# Altium project Intelligent-bookcase-management-system.PrjPcb
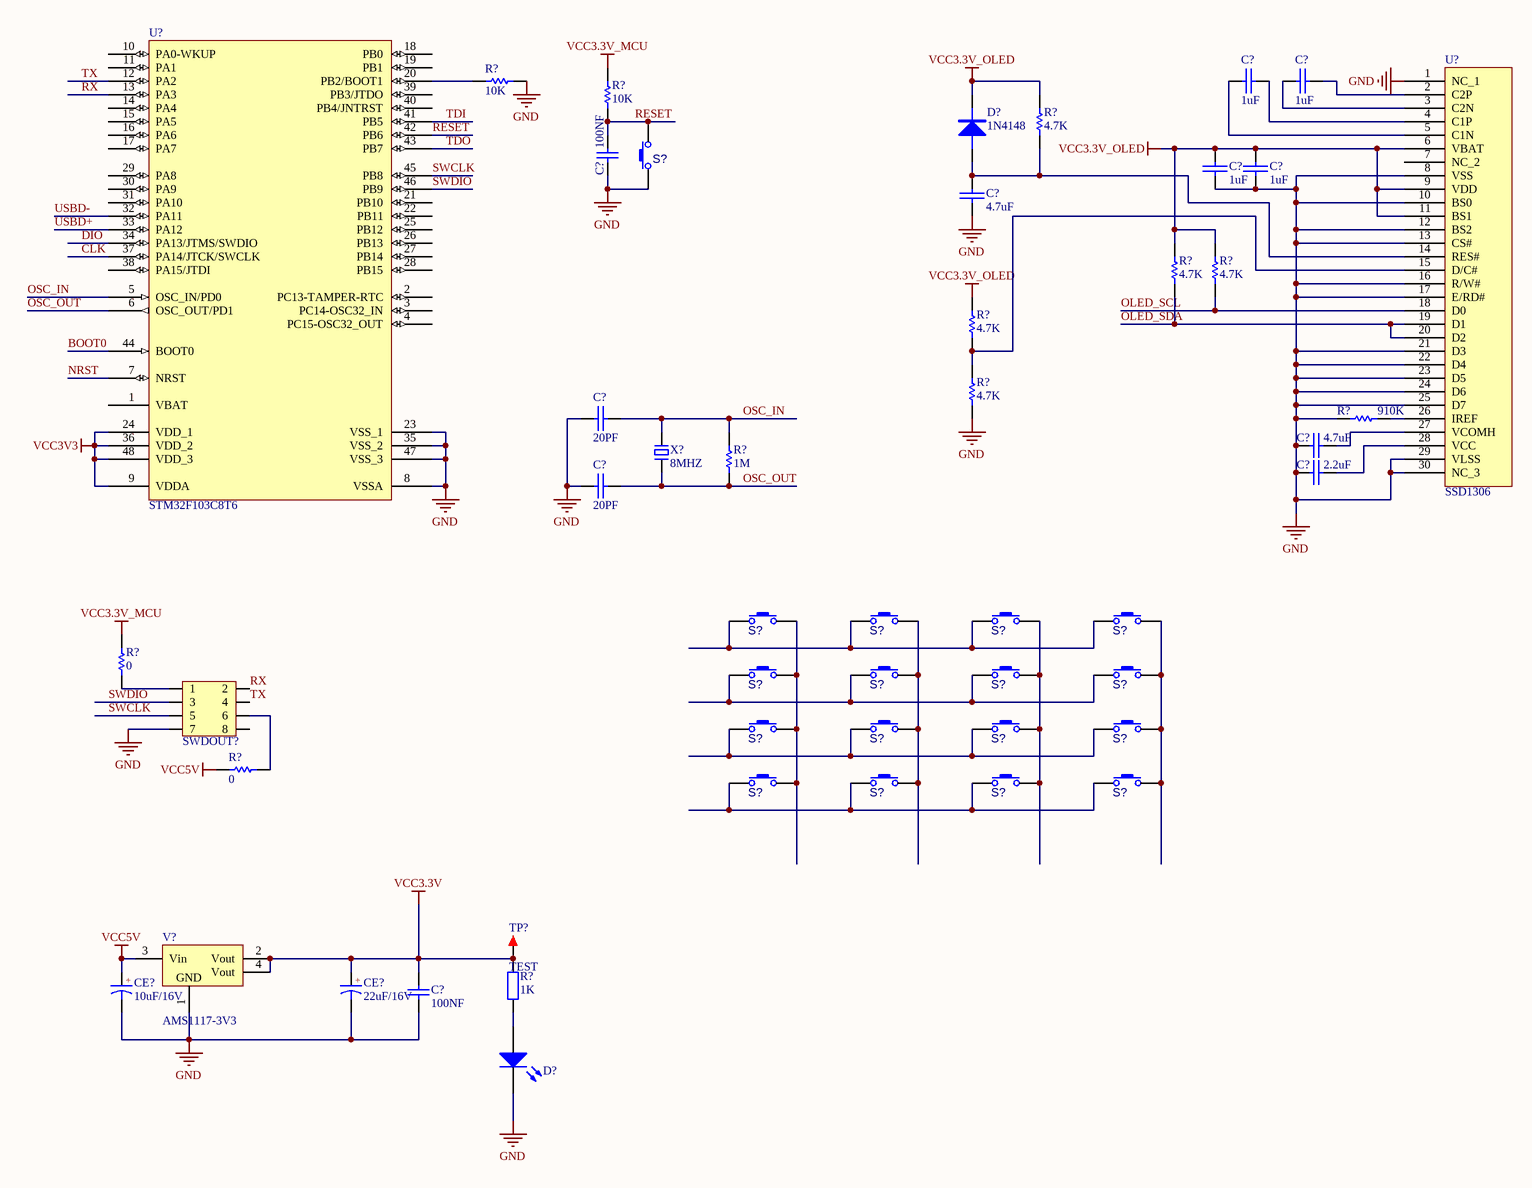
[diagram p0: Intelligent-bookcase-management-system.SchDoc]
1 sheet, 50 parts. Net scope: global (net labels, ports and power ports of the same name join across sheets).
Board file: Intelligent-bookcase-management-system.PcbDoc

## Sheet Intelligent-bookcase-management-system.SchDoc
size A3; SheetNumber: 1; SheetTotal: 1

### Parts
(Parts that share a designator on the sheet are numbered #1, #2 ... from top to bottom, then left to right.)
C?#1  1uF  [0603C]
C?#2  1uF  [0603C]
C?#3  100NF  [0603C]
C?#4  4.7uF  [0603C]
C?#5  1uF  [0603C]
C?#6  1uF  [0603C]
C?#7  20PF  [0402C]
C?#8  4.7uF  [0603C]
C?#9  2.2uF  [0603C]
C?#10  20PF  [0402C]
C?#11  100NF  [0603C]
CE?#1  10uF/16V  [DIP-EC2.0X5X11]
CE?#2  22uF/16V  [DIP-EC2.0X5X11]
D?#1  1N4148  [SOD-323]
D?#2  LED  [LED 0603W]  (value not drawn)
R?#1  10K  [0603R]
R?#2  10K  [0603R]
R?#3  4.7K  [0603R]
R?#4  4.7K  [0603R]
R?#5  4.7K  [0603R]
R?#6  4.7K  [0603R]
R?#7  4.7K  [0603R]
R?#8  910K  [0603R]
R?#9  1M  [0402R]
R?#10  0  [0603R]
R?#11  0  [0603R]
R?#12  1K  [0603R]
S?#1  Button  [SW-SMD_L6.0-W6.0-LS6.6]  (value not drawn)
S?#2  Button  [SW-SMD_L6.0-W6.0-LS6.6]  (value not drawn)
S?#3  Button  [SW-SMD_L6.0-W6.0-LS6.6]  (value not drawn)
S?#4  Button  [SW-SMD_L6.0-W6.0-LS6.6]  (value not drawn)
S?#5  Button  [SW-SMD_L6.0-W6.0-LS6.6]  (value not drawn)
S?#6  Button  [SW-SMD_L6.0-W6.0-LS6.6]  (value not drawn)
S?#7  Button  [SW-SMD_L6.0-W6.0-LS6.6]  (value not drawn)
S?#8  Button  [SW-SMD_L6.0-W6.0-LS6.6]  (value not drawn)
S?#9  Button  [SW-SMD_L6.0-W6.0-LS6.6]  (value not drawn)
S?#10  Button  [SW-SMD_L6.0-W6.0-LS6.6]  (value not drawn)
S?#11  Button  [SW-SMD_L6.0-W6.0-LS6.6]  (value not drawn)
S?#12  Button  [SW-SMD_L6.0-W6.0-LS6.6]  (value not drawn)
S?#13  Button  [SW-SMD_L6.0-W6.0-LS6.6]  (value not drawn)
S?#14  Button  [SW-SMD_L6.0-W6.0-LS6.6]  (value not drawn)
S?#15  Button  [SW-SMD_L6.0-W6.0-LS6.6]  (value not drawn)
S?#16  Button  [SW-SMD_L6.0-W6.0-LS6.6]  (value not drawn)
S?#17  Button  [SW-SMD_L6.0-W6.0-LS6.6]  (value not drawn)
SWDOUT?  HDR2x4_2.54  [Pin HDR2X4/2.54mm-S]  (value not drawn)
TP?  TEST  [TEST 1.6]
U?#1  STM32F103C8T6  [LQFP48 7X7]
U?#2  SSD1306  [OLED_0.96-30P-P0.70-12864]
V?  AMS1117-3V3  [SOT223]
X?  8MHZ  [OSC HC-49SMD]

### Nets
GND: C?#3.1 C?#4.2 C?#5.1 C?#6.1 C?#7.2 C?#8.2 C?#9.2 C?#10.2 C?#11.2 CE?#1.2 CE?#2.2 D?#2.2(K) R?#1.1 R?#7.1 R?#8.2 S?#1.2 SWDOUT?.7 U?#1.8(VSSA) U?#1.23(VSS_1) U?#1.35(VSS_2) U?#1.47(VSS_3) U?#2.1(NC_1) U?#2.8(VSS) U?#2.10(BS0) U?#2.12(BS2) U?#2.13(CS#) U?#2.16(R/W#) U?#2.17(E/RD#) U?#2.21(D3) U?#2.22(D4) U?#2.23(D5) U?#2.24(D6) U?#2.25(D7) U?#2.29(VLSS) U?#2.30(NC_3) V?.1(GND)
VCC3.3V: C?#11.1 CE?#2.1 R?#12.2 TP?.1 V?.2(Vout) V?.4(Vout)
VCC3.3V_MCU: R?#2.2 R?#10.2
VCC3.3V_OLED: C?#5.2 C?#6.2 D?#1.K R?#3.2 R?#4.2 R?#5.2 R?#6.2 U?#2.6(VBAT) U?#2.9(VDD) U?#2.11(BS1)
VCC3V3: U?#1.9(VDDA) U?#1.24(VDD_1) U?#1.36(VDD_2) U?#1.48(VDD_3)
VCC5V: CE?#1.1 R?#11.2 V?.3(Vin)
BOOT0: U?#1.44(BOOT0)
CLK: U?#1.37(PA14/JTCK/SWCLK)
DIO: U?#1.34(PA13/JTMS/SWDIO)
NRST: U?#1.7(NRST)
OLED_SCL: R?#5.1 U?#2.18(D0)
OLED_SDA: R?#4.1 U?#2.19(D1) U?#2.20(D2)
OSC_IN: C?#7.1 R?#9.2 U?#1.5(OSC_IN/PD0) X?.2
OSC_OUT: C?#10.1 R?#9.1 U?#1.6(OSC_OUT/PD1) X?.1
RESET: C?#3.2 R?#2.1 S?#1.1 U?#1.42(PB6)
RX: SWDOUT?.2 U?#1.13(PA3)
SWCLK: SWDOUT?.5 U?#1.45(PB8)
SWDIO: SWDOUT?.3 U?#1.46(PB9)
TDI: U?#1.41(PB5)
TDO: U?#1.43(PB7)
TX: SWDOUT?.4 U?#1.12(PA2)
USBD+: U?#1.33(PA12)
USBD-: U?#1.32(PA11)
NetC?#1_1: C?#1.1 U?#2.5(C1N)
NetC?#1_2: C?#1.2 U?#2.4(C1P)
NetC?#2_1: C?#2.1 U?#2.3(C2N)
NetC?#2_2: C?#2.2 U?#2.2(C2P)
NetC?#4_1: C?#4.1 D?#1.A R?#3.1 U?#2.14(RES#)
NetC?#8_1: C?#8.1 U?#2.27(VCOMH)
NetC?#9_1: C?#9.1 U?#2.28(VCC)
NetD?#2_1: D?#2.1(A) R?#12.1
NetR?#1_2: R?#1.2 U?#1.20(PB2/BOOT1)
NetR?#6_1: R?#6.1 R?#7.2 U?#2.15(D/C#)
NetR?#8_1: R?#8.1 U?#2.26(IREF)
NetR?#10_1: R?#10.1 SWDOUT?.1
NetR?#11_1: R?#11.1 SWDOUT?.6
NetS?#2_1: S?#2.1 S?#6.1 S?#10.1 S?#14.1
NetS?#2_2: S?#2.2 S?#3.2 S?#4.2 S?#5.2
NetS?#3_1: S?#3.1 S?#7.1 S?#11.1 S?#15.1
NetS?#4_1: S?#4.1 S?#8.1 S?#12.1 S?#16.1
NetS?#5_1: S?#5.1 S?#9.1 S?#13.1 S?#17.1
NetS?#6_2: S?#6.2 S?#7.2 S?#8.2 S?#9.2
NetS?#10_2: S?#10.2 S?#11.2 S?#12.2 S?#13.2
NetS?#14_2: S?#14.2 S?#15.2 S?#16.2 S?#17.2

Not connected (* = marked no-connect by the designer): SWDOUT? 8; U?#1 1(VBAT) 2(PC13-TAMPER-RTC) 3(PC14-OSC32_IN) 4(PC15-OSC32_OUT) 10(PA0-WKUP) 11(PA1) 14(PA4) 15(PA5) 16(PA6) 17(PA7) 18(PB0) 19(PB1) 21(PB10) 22(PB11) 25(PB12) 26(PB13) 27(PB14) 28(PB15) 29(PA8) 30(PA9) 31(PA10) 38(PA15/JTDI) 39(PB3/JTDO) 40(PB4/JNTRST); U?#2 7(NC_2)

### Notes on the sheet
- (in symbol CE) +

### Library data of the parts
C?#1 C?#2 C?#4-C?#10 = CAP: 无极性电容
C?#3 C?#11 = C: 贴片电容; BOM名称: 无极性贴片电容; 联系卖家，免费查找封装: 唯一出售店铺网址https://shop463601444.taobao.com
CE?#1 CE?#2 = CE: 直插电解电容; 联系卖家，免费查找封装: 唯一出售店铺网址https://shop463601444.taobao.com; 封装库来自淘宝卖家ID：黄晶宝石: 其他店铺购入均为盗版假冒封装库，请立即申请退款; BOM名称: 直插电解电容
D?#1 = DIODE: 普通二极管
D?#2 = LED: 发光二极管; 封装库来自淘宝卖家 ID：黄晶宝石: 其他店铺购入均为假冒，请立即申请退款，本店奖励现金5~20元
R?#1-R?#11 = RES
R?#12 = R: 贴片电阻; 联系卖家，免费查找封装: 唯一出售店铺网址https://shop463601444.taobao.com; 封装库来自淘宝卖家ID：黄晶宝石: 其他店铺购入均为盗版假冒封装库，请立即申请退款; BOM名称: 贴片电阻
S?#1-S?#17 = KEY: 按键; Published: 24-Mar-1999; Publisher: Altium Limited; Price(RMB): 0.000
SWDOUT? = HDR2x4_2.54: Header
TP? = TEST: 测试点; 联系卖家，免费查找封装: 唯一出售店铺网址https://shop463601444.taobao.com; BOM名称: 测试点
V? = AMS1117: 三端稳压芯片; BOM名称: 稳压芯片; 封装库来自淘宝卖家 ID：黄晶宝石: 其他店铺购入均为盗版，请立即申请退款，本店现金奖励5~20元; 联系卖家 免费查找封装: 唯一出售店铺网址https://shop463601444.taobao.com
X? = XTAL-2P: 2脚无源脚晶振